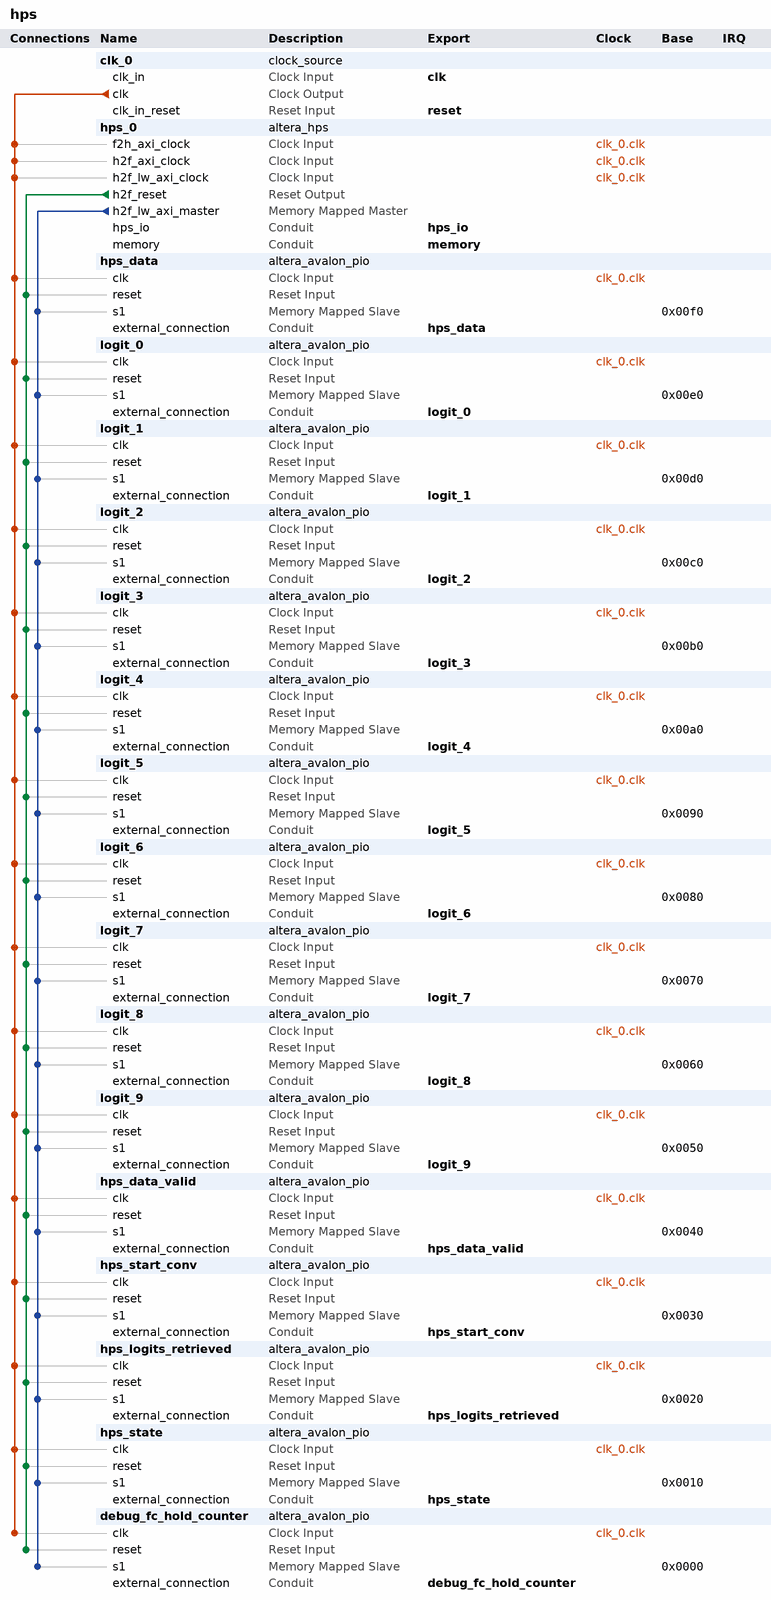
[diagram p0: system contents]
# Platform Designer (Qsys) system hps, Cyclone V 5CSEMA5F31C6
# Parameters at their usual value, and those the tool derives, are not listed.
package require -exact qsys 21.1
create_system hps
set_project_property DEVICE_FAMILY {Cyclone V}
set_project_property DEVICE 5CSEMA5F31C6

add_instance clk_0 clock_source 21.1
set_instance_parameter_value clk_0 clockFrequency 50000000

add_instance hps_0 altera_hps 21.1
set_instance_parameter_value hps_0 EMAC1_Mode RGMII
set_instance_parameter_value hps_0 EMAC1_PinMuxing {HPS I/O Set 0}
set_instance_parameter_value hps_0 F2SCLK_COLDRST_Enable false
set_instance_parameter_value hps_0 F2SCLK_DBGRST_Enable false
set_instance_parameter_value hps_0 F2SCLK_WARMRST_Enable false
set_instance_parameter_value hps_0 F2SINTERRUPT_Enable false
set_instance_parameter_value hps_0 F2S_Width 2
set_instance_parameter_value hps_0 FPGA_PERIPHERAL_OUTPUT_CLOCK_FREQ_EMAC0_GTX_CLK 125
set_instance_parameter_value hps_0 FPGA_PERIPHERAL_OUTPUT_CLOCK_FREQ_EMAC0_MD_CLK 2.5
set_instance_parameter_value hps_0 FPGA_PERIPHERAL_OUTPUT_CLOCK_FREQ_EMAC1_GTX_CLK 125
set_instance_parameter_value hps_0 FPGA_PERIPHERAL_OUTPUT_CLOCK_FREQ_EMAC1_MD_CLK 2.5
set_instance_parameter_value hps_0 HPS_PROTOCOL DDR3
set_instance_parameter_value hps_0 I2C0_Mode N/A
set_instance_parameter_value hps_0 I2C0_PinMuxing Unused
set_instance_parameter_value hps_0 I2C1_Mode N/A
set_instance_parameter_value hps_0 I2C1_PinMuxing Unused
set_instance_parameter_value hps_0 LWH2F_Enable true
set_instance_parameter_value hps_0 MEM_BANKADDR_WIDTH 3
set_instance_parameter_value hps_0 MEM_CLK_FREQ 400.0
set_instance_parameter_value hps_0 MEM_COL_ADDR_WIDTH 10
set_instance_parameter_value hps_0 MEM_DQ_WIDTH 32
set_instance_parameter_value hps_0 MEM_DRV_STR RZQ/7
set_instance_parameter_value hps_0 MEM_ROW_ADDR_WIDTH 15
set_instance_parameter_value hps_0 MEM_RTT_NOM RZQ/4
set_instance_parameter_value hps_0 MEM_RTT_WR {Dynamic ODT off}
set_instance_parameter_value hps_0 MEM_TCL 11
set_instance_parameter_value hps_0 MEM_TFAW_NS 30.0
set_instance_parameter_value hps_0 MEM_TRAS_NS 35.0
set_instance_parameter_value hps_0 MEM_TRCD_NS 13.75
set_instance_parameter_value hps_0 MEM_TRFC_NS 260.0
set_instance_parameter_value hps_0 MEM_TRP_NS 13.75
set_instance_parameter_value hps_0 MEM_VENDOR JEDEC
set_instance_parameter_value hps_0 MEM_WTCL 8
set_instance_parameter_value hps_0 QSPI_Mode N/A
set_instance_parameter_value hps_0 QSPI_PinMuxing Unused
set_instance_parameter_value hps_0 REF_CLK_FREQ 25.0
set_instance_parameter_value hps_0 S2FCLK_USER2CLK 5
set_instance_parameter_value hps_0 S2F_Width 2
set_instance_parameter_value hps_0 SDIO_Mode {4-bit Data}
set_instance_parameter_value hps_0 SDIO_PinMuxing {HPS I/O Set 0}
set_instance_parameter_value hps_0 SPIM1_Mode N/A
set_instance_parameter_value hps_0 SPIM1_PinMuxing Unused
set_instance_parameter_value hps_0 STM_Enable false
set_instance_parameter_value hps_0 TIMING_BOARD_AC_SKEW 0.03
set_instance_parameter_value hps_0 TIMING_BOARD_AC_TO_CK_SKEW 0.0
set_instance_parameter_value hps_0 TIMING_BOARD_DQ_TO_DQS_SKEW 0.0
set_instance_parameter_value hps_0 TIMING_BOARD_MAX_CK_DELAY 0.03
set_instance_parameter_value hps_0 TIMING_BOARD_MAX_DQS_DELAY 0.02
set_instance_parameter_value hps_0 TIMING_BOARD_SKEW_BETWEEN_DQS 0.08
set_instance_parameter_value hps_0 TIMING_BOARD_SKEW_CKDQS_DIMM_MAX 0.16
set_instance_parameter_value hps_0 TIMING_BOARD_SKEW_CKDQS_DIMM_MIN 0.09
set_instance_parameter_value hps_0 TIMING_BOARD_SKEW_WITHIN_DQS 0.01
set_instance_parameter_value hps_0 TIMING_TDH 65
set_instance_parameter_value hps_0 TIMING_TDQSCK 255
set_instance_parameter_value hps_0 TIMING_TDQSQ 125
set_instance_parameter_value hps_0 TIMING_TDS 30
set_instance_parameter_value hps_0 TIMING_TIH 140
set_instance_parameter_value hps_0 TIMING_TIS 180
set_instance_parameter_value hps_0 TIMING_TQSH 0.4
set_instance_parameter_value hps_0 UART0_Mode {No Flow Control}
set_instance_parameter_value hps_0 UART0_PinMuxing {HPS I/O Set 0}
set_instance_parameter_value hps_0 USB1_Mode SDR
set_instance_parameter_value hps_0 USB1_PinMuxing {HPS I/O Set 0}
set_instance_parameter_value hps_0 desired_cfg_clk_mhz 100.0
set_instance_parameter_value hps_0 desired_qspi_clk_mhz 400.0

add_instance hps_data altera_avalon_pio 21.1
set_instance_parameter_value hps_data direction Output
set_instance_parameter_value hps_data width 32

add_instance logit_0 altera_avalon_pio 21.1
set_instance_parameter_value logit_0 direction Input
set_instance_parameter_value logit_0 width 32

add_instance logit_1 altera_avalon_pio 21.1
set_instance_parameter_value logit_1 direction Input
set_instance_parameter_value logit_1 width 32

add_instance logit_2 altera_avalon_pio 21.1
set_instance_parameter_value logit_2 direction Input
set_instance_parameter_value logit_2 width 32

add_instance logit_3 altera_avalon_pio 21.1
set_instance_parameter_value logit_3 direction Input
set_instance_parameter_value logit_3 width 32

add_instance logit_4 altera_avalon_pio 21.1
set_instance_parameter_value logit_4 direction Input
set_instance_parameter_value logit_4 width 32

add_instance logit_5 altera_avalon_pio 21.1
set_instance_parameter_value logit_5 direction Input
set_instance_parameter_value logit_5 width 32

add_instance logit_6 altera_avalon_pio 21.1
set_instance_parameter_value logit_6 direction Input
set_instance_parameter_value logit_6 width 32

add_instance logit_7 altera_avalon_pio 21.1
set_instance_parameter_value logit_7 direction Input
set_instance_parameter_value logit_7 width 32

add_instance logit_8 altera_avalon_pio 21.1
set_instance_parameter_value logit_8 direction Input
set_instance_parameter_value logit_8 width 32

add_instance logit_9 altera_avalon_pio 21.1
set_instance_parameter_value logit_9 direction Input
set_instance_parameter_value logit_9 width 32

add_instance hps_data_valid altera_avalon_pio 21.1
set_instance_parameter_value hps_data_valid direction Output
set_instance_parameter_value hps_data_valid width 1

add_instance hps_start_conv altera_avalon_pio 21.1
set_instance_parameter_value hps_start_conv direction Output
set_instance_parameter_value hps_start_conv width 1

add_instance hps_logits_retrieved altera_avalon_pio 21.1
set_instance_parameter_value hps_logits_retrieved direction Output
set_instance_parameter_value hps_logits_retrieved width 1

add_instance hps_state altera_avalon_pio 21.1
set_instance_parameter_value hps_state direction Input
set_instance_parameter_value hps_state width 8

add_instance debug_fc_hold_counter altera_avalon_pio 21.1
set_instance_parameter_value debug_fc_hold_counter direction Input
set_instance_parameter_value debug_fc_hold_counter width 32

# connections
add_connection clk_0.clk debug_fc_hold_counter.clk clock
add_connection clk_0.clk hps_0.f2h_axi_clock clock
add_connection clk_0.clk hps_0.h2f_axi_clock clock
add_connection clk_0.clk hps_0.h2f_lw_axi_clock clock
add_connection clk_0.clk hps_data.clk clock
add_connection clk_0.clk hps_data_valid.clk clock
add_connection clk_0.clk hps_logits_retrieved.clk clock
add_connection clk_0.clk hps_start_conv.clk clock
add_connection clk_0.clk hps_state.clk clock
add_connection clk_0.clk logit_0.clk clock
add_connection clk_0.clk logit_1.clk clock
add_connection clk_0.clk logit_2.clk clock
add_connection clk_0.clk logit_3.clk clock
add_connection clk_0.clk logit_4.clk clock
add_connection clk_0.clk logit_5.clk clock
add_connection clk_0.clk logit_6.clk clock
add_connection clk_0.clk logit_7.clk clock
add_connection clk_0.clk logit_8.clk clock
add_connection clk_0.clk logit_9.clk clock
add_connection hps_0.h2f_reset debug_fc_hold_counter.reset reset
add_connection hps_0.h2f_reset hps_data.reset reset
add_connection hps_0.h2f_reset hps_data_valid.reset reset
add_connection hps_0.h2f_reset hps_logits_retrieved.reset reset
add_connection hps_0.h2f_reset hps_start_conv.reset reset
add_connection hps_0.h2f_reset hps_state.reset reset
add_connection hps_0.h2f_reset logit_0.reset reset
add_connection hps_0.h2f_reset logit_1.reset reset
add_connection hps_0.h2f_reset logit_2.reset reset
add_connection hps_0.h2f_reset logit_3.reset reset
add_connection hps_0.h2f_reset logit_4.reset reset
add_connection hps_0.h2f_reset logit_5.reset reset
add_connection hps_0.h2f_reset logit_6.reset reset
add_connection hps_0.h2f_reset logit_7.reset reset
add_connection hps_0.h2f_reset logit_8.reset reset
add_connection hps_0.h2f_reset logit_9.reset reset
add_connection hps_0.h2f_lw_axi_master debug_fc_hold_counter.s1 avalon
set_connection_parameter_value hps_0.h2f_lw_axi_master/debug_fc_hold_counter.s1 baseAddress 0x0000
add_connection hps_0.h2f_lw_axi_master hps_data.s1 avalon
set_connection_parameter_value hps_0.h2f_lw_axi_master/hps_data.s1 baseAddress 0x00f0
add_connection hps_0.h2f_lw_axi_master hps_data_valid.s1 avalon
set_connection_parameter_value hps_0.h2f_lw_axi_master/hps_data_valid.s1 baseAddress 0x0040
add_connection hps_0.h2f_lw_axi_master hps_logits_retrieved.s1 avalon
set_connection_parameter_value hps_0.h2f_lw_axi_master/hps_logits_retrieved.s1 baseAddress 0x0020
add_connection hps_0.h2f_lw_axi_master hps_start_conv.s1 avalon
set_connection_parameter_value hps_0.h2f_lw_axi_master/hps_start_conv.s1 baseAddress 0x0030
add_connection hps_0.h2f_lw_axi_master hps_state.s1 avalon
set_connection_parameter_value hps_0.h2f_lw_axi_master/hps_state.s1 baseAddress 0x0010
add_connection hps_0.h2f_lw_axi_master logit_0.s1 avalon
set_connection_parameter_value hps_0.h2f_lw_axi_master/logit_0.s1 baseAddress 0x00e0
add_connection hps_0.h2f_lw_axi_master logit_1.s1 avalon
set_connection_parameter_value hps_0.h2f_lw_axi_master/logit_1.s1 baseAddress 0x00d0
add_connection hps_0.h2f_lw_axi_master logit_2.s1 avalon
set_connection_parameter_value hps_0.h2f_lw_axi_master/logit_2.s1 baseAddress 0x00c0
add_connection hps_0.h2f_lw_axi_master logit_3.s1 avalon
set_connection_parameter_value hps_0.h2f_lw_axi_master/logit_3.s1 baseAddress 0x00b0
add_connection hps_0.h2f_lw_axi_master logit_4.s1 avalon
set_connection_parameter_value hps_0.h2f_lw_axi_master/logit_4.s1 baseAddress 0x00a0
add_connection hps_0.h2f_lw_axi_master logit_5.s1 avalon
set_connection_parameter_value hps_0.h2f_lw_axi_master/logit_5.s1 baseAddress 0x0090
add_connection hps_0.h2f_lw_axi_master logit_6.s1 avalon
set_connection_parameter_value hps_0.h2f_lw_axi_master/logit_6.s1 baseAddress 0x0080
add_connection hps_0.h2f_lw_axi_master logit_7.s1 avalon
set_connection_parameter_value hps_0.h2f_lw_axi_master/logit_7.s1 baseAddress 0x0070
add_connection hps_0.h2f_lw_axi_master logit_8.s1 avalon
set_connection_parameter_value hps_0.h2f_lw_axi_master/logit_8.s1 baseAddress 0x0060
add_connection hps_0.h2f_lw_axi_master logit_9.s1 avalon
set_connection_parameter_value hps_0.h2f_lw_axi_master/logit_9.s1 baseAddress 0x0050

# exported interfaces
add_interface clk clock sink
set_interface_property clk EXPORT_OF clk_0.clk_in
add_interface debug_fc_hold_counter conduit end
set_interface_property debug_fc_hold_counter EXPORT_OF debug_fc_hold_counter.external_connection
add_interface hps_data conduit end
set_interface_property hps_data EXPORT_OF hps_data.external_connection
add_interface hps_data_valid conduit end
set_interface_property hps_data_valid EXPORT_OF hps_data_valid.external_connection
add_interface hps_io conduit end
set_interface_property hps_io EXPORT_OF hps_0.hps_io
add_interface hps_logits_retrieved conduit end
set_interface_property hps_logits_retrieved EXPORT_OF hps_logits_retrieved.external_connection
add_interface hps_start_conv conduit end
set_interface_property hps_start_conv EXPORT_OF hps_start_conv.external_connection
add_interface hps_state conduit end
set_interface_property hps_state EXPORT_OF hps_state.external_connection
add_interface logit_0 conduit end
set_interface_property logit_0 EXPORT_OF logit_0.external_connection
add_interface logit_1 conduit end
set_interface_property logit_1 EXPORT_OF logit_1.external_connection
add_interface logit_2 conduit end
set_interface_property logit_2 EXPORT_OF logit_2.external_connection
add_interface logit_3 conduit end
set_interface_property logit_3 EXPORT_OF logit_3.external_connection
add_interface logit_4 conduit end
set_interface_property logit_4 EXPORT_OF logit_4.external_connection
add_interface logit_5 conduit end
set_interface_property logit_5 EXPORT_OF logit_5.external_connection
add_interface logit_6 conduit end
set_interface_property logit_6 EXPORT_OF logit_6.external_connection
add_interface logit_7 conduit end
set_interface_property logit_7 EXPORT_OF logit_7.external_connection
add_interface logit_8 conduit end
set_interface_property logit_8 EXPORT_OF logit_8.external_connection
add_interface logit_9 conduit end
set_interface_property logit_9 EXPORT_OF logit_9.external_connection
add_interface memory conduit end
set_interface_property memory EXPORT_OF hps_0.memory
add_interface reset reset sink
set_interface_property reset EXPORT_OF clk_0.clk_in_reset

set_interconnect_requirement {$system} qsys_mm.clockCrossingAdapter HANDSHAKE
set_interconnect_requirement {$system} qsys_mm.enableEccProtection FALSE
set_interconnect_requirement {$system} qsys_mm.insertDefaultSlave FALSE
set_interconnect_requirement {$system} qsys_mm.maxAdditionalLatency 1

save_system hps.qsys
